# EasyEDA Pro project 航姿仪.epro

# Schematic 航姿仪原理图
Board Name: 发射板; Create Date: 2024-08-19; Page Name: P1; Project Name: 棒棒1.0; Schematic Name: 发射板原理图; Update Date: 2024-08-22
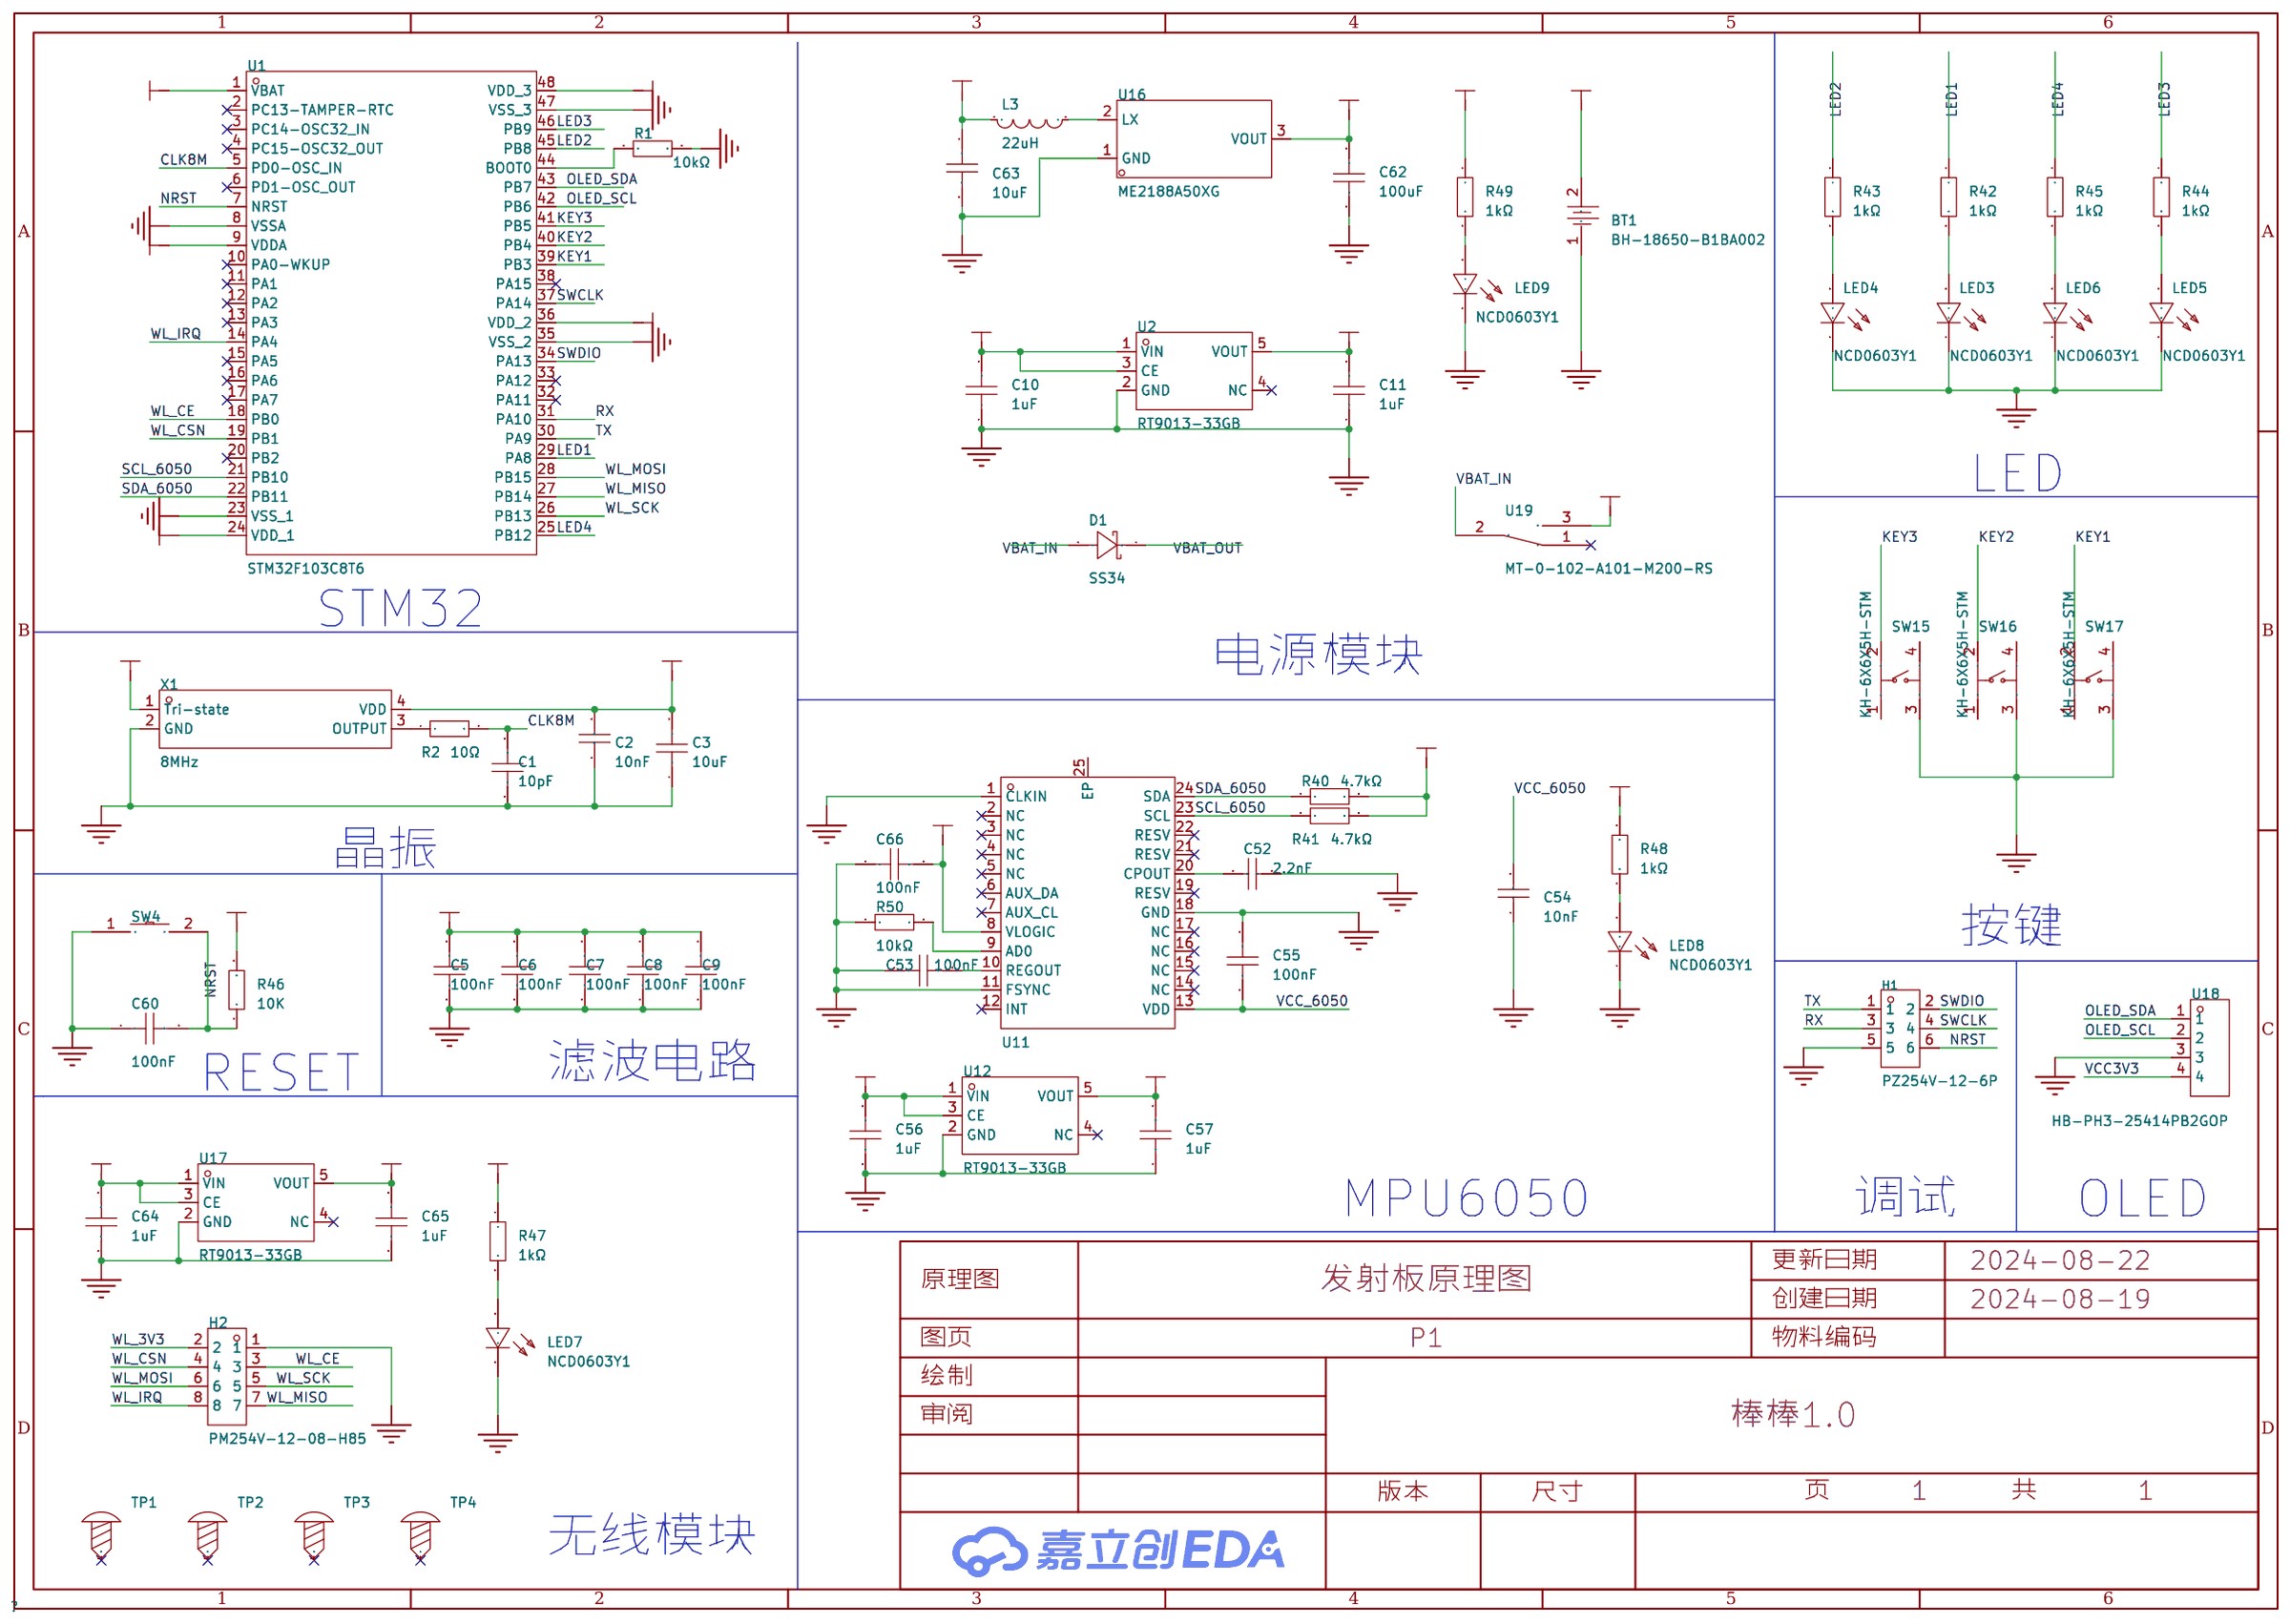
[diagram p0: schematic sheet]

## Parts
BT1  BH-18650-B1BA002  [BATTERY-SMD_18650-1S-L77.1-W20.7-1]
C1  10pF  [C0603]
C2  10nF  [C0603]
C3  10uF  [C0603]
C5  100nF  [C0603]
C6  100nF  [C0603]
C7  100nF  [C0603]
C8  100nF  [C0603]
C9  100nF  [C0603]
C10  1uF  [C0603]
C11  1uF  [C0603]
C52  2.2nF  [C0603]
C53  100nF  [C0603]
C54  10nF  [C0603]
C55  100nF  [C0603]
C56  1uF  [C0603]
C57  1uF  [C0603]
C60  100nF  [C0603]
C62  100uF  [C0603]
C63  10uF  [C0603]
C64  1uF  [C0603]
C65  1uF  [C0603]
C66  100nF  [C0603]
D1  SS34  [SMA_L4.3-W2.5-LS5.0-RD]
H1  PZ254V-12-6P  [HDR-TH_6P-P2.54-V-M-R2-C3-S2.54]
H2  PM254V-12-08-H85  [HDR-TH_8P-P2.54-V-F-R2-C4-S2.54]
L3  22uH  [IND-SMD_L7.1-W6.6]
LED3  NCD0603Y1  [LED0603-RD]
LED4  NCD0603Y1  [LED0603-RD]
LED5  NCD0603Y1  [LED0603-RD]
LED6  NCD0603Y1  [LED0603-RD]
LED7  NCD0603Y1  [LED0603-RD]
LED8  NCD0603Y1  [LED0603-RD]
LED9  NCD0603Y1  [LED0603-RD]
R1  10kΩ  [R0603]
R2  10Ω  [R0603]
R40  4.7kΩ  [R0603]
R41  4.7kΩ  [R0603]
R42  1kΩ  [R0603]
R43  1kΩ  [R0603]
R44  1kΩ  [R0603]
R45  1kΩ  [R0603]
R46  10K  [R0603]
R47  1kΩ  [R0603]
R48  1kΩ  [R0603]
R49  1kΩ  [R0603]
R50  10kΩ  [R0603]
SW4  TS-1101-C-W  [SW-SMD_L6.0-W3.3-LS8.0]
SW15  KH-6X6X5H-STM  [SW-SMD_4P-L6.0-W6.0-P4.50-LS9.0-2]
SW16  KH-6X6X5H-STM  [SW-SMD_4P-L6.0-W6.0-P4.50-LS9.0-2]
SW17  KH-6X6X5H-STM  [SW-SMD_4P-L6.0-W6.0-P4.50-LS9.0-2]
TP1  -  [M3螺丝]
TP2  -  [M3螺丝]
TP3  -  [M3螺丝]
TP4  -  [M3螺丝]
U1  STM32F103C8T6  [LQFP-48_L7.0-W7.0-P0.50-LS9.0-BL]
U2  RT9013-33GB  [SOT-23-5_L2.9-W1.6-P0.95-LS2.8-BR]
U11  MPU-6050  [QFN-24_L4.0-W4.0-P0.50-BL-EP2.7]
U12  RT9013-33GB  [SOT-23-5_L2.9-W1.6-P0.95-LS2.8-BR]
U16  ME2188A50XG  [SOT-23-3_L2.9-W1.6-P1.90-LS2.8-BR]
U17  RT9013-33GB  [SOT-23-5_L2.9-W1.6-P0.95-LS2.8-BR]
U18  HB-PH3-25414PB2GOP  [HDR-TH_4P-P2.54-V-M]
U19  MT-0-102-A101-M200-RS  [SW-TH_MT-0-103-A101-M200-RS]
X1  8MHz  [OSC-SMD_4P-L3.2-W2.5-BL_SIT8008BI]

## Library data of the parts
BT1 = BH-18650-B1BA002: 连接器类型:电池盒;适用电池规格:18650;; LCSC Part Name: 电池盒 适用电池:18650; Supplier Part: C2988620; Manufacturer: MYOUNG(美阳); Supplier Footprint: SMD; JLCPCB Part Class: 扩展库; Datasheet: https://atta.szlcsc.com/upload/public/pdf/source/20220402/870DB99AB50CA0DF8D51CF7C86A51FAB.pdf; Supplier: LCSC; Connector Type: 电池盒; Battery Type: 18650
C1 = 0603CG100J500NT: 容值:10pF;精度:±5%;额定电压:50V;材质(温度系数):C0G;; LCSC Part Name: 10pF ±5% 50V; Supplier Part: C91367; Manufacturer: FH(风华); Supplier Footprint: 0603; JLCPCB Part Class: 扩展库; Datasheet: https://atta.szlcsc.com/upload/public/pdf/source/20200305/C486355_26A10D38EF8C2A5C37091D0039909270.pdf; Supplier: LCSC; Tolerance: ±5%; Voltage Rated: 50V; Temperature Coefficient: C0G
C2 = 0603B103K500NT: 容值:10nF;精度:±10%;额定电压:50V;材质(温度系数):X7R;; LCSC Part Name: 10nF ±10% 50V; Supplier Part: C57112; Manufacturer: FH(风华); Supplier Footprint: 0603; JLCPCB Part Class: 基础库; Datasheet: https://atta.szlcsc.com/upload/public/pdf/source/20200305/C486355_26A10D38EF8C2A5C37091D0039909270.pdf; Supplier: LCSC; Tolerance: ±10%; Voltage Rated: 50V; Temperature Coefficient: X7R
C3 = CL10A106KP8NNNC: 容值:10uF;精度:±10%;额定电压:10V;材质(温度系数):X5R;; LCSC Part Name: 10uF ±10% 10V; Supplier Part: C19702; Manufacturer: SAMSUNG(三星); Supplier Footprint: 0603; JLCPCB Part Class: 基础库; Datasheet: https://atta.szlcsc.com/upload/public/pdf/source/20160218/1457707763339.pdf; Supplier: LCSC; Tolerance: ±10%; Voltage Rated: 10V; Temperature Coefficient: X5R
C5-C9 C53 C55 C66 = CC0603KRX7R9BB104: 容值:100nF;精度:±10%;额定电压:50V;材质(温度系数):X7R;; LCSC Part Name: 100nF ±10% 50V; Supplier Part: C14663; Manufacturer: YAGEO(国巨); Supplier Footprint: 0603; JLCPCB Part Class: 基础库; Datasheet: https://atta.szlcsc.com/upload/public/pdf/source/20180910/C282072_33301C7F631E79921B82A8DAC6BCC5B3.pdf; Supplier: LCSC; Tolerance: ±10%; Voltage Rated: 50V; Temperature Coefficient: X7R
C10 C11 C56 C57 C64 C65 = CL10A105KB8NNNC: 容值:1uF;精度:±10%;额定电压:50V;材质(温度系数):X5R;; LCSC Part Name: 1uF ±10% 50V; Supplier Part: C15849; Manufacturer: SAMSUNG(三星); Supplier Footprint: 0603; JLCPCB Part Class: 基础库; Datasheet: https://atta.szlcsc.com/upload/public/pdf/source/20160218/1457707763339.pdf; Supplier: LCSC; Tolerance: ±10%; Voltage Rated: 50V; Temperature Coefficient: X5R
C52 = 0603B222J500NT: 容值:2.2nF;精度:±5%;额定电压:50V;材质(温度系数):X7R;; LCSC Part Name: 2.2nF ±5% 50V; Supplier Part: C60328; Manufacturer: FH(风华); Supplier Footprint: 0603; JLCPCB Part Class: 扩展库; Datasheet: https://atta.szlcsc.com/upload/public/pdf/source/20200305/C486355_26A10D38EF8C2A5C37091D0039909270.pdf; Supplier: LCSC; Tolerance: ±5%; Voltage Rated: 50V; Temperature Coefficient: X7R
C54 = CC0603KRX7R9BB103: 容值:10nF;精度:±10%;额定电压:50V;材质(温度系数):X7R;; LCSC Part Name: 10nF ±10% 50V; Supplier Part: C100042; Manufacturer: YAGEO(国巨); Supplier Footprint: 0603; JLCPCB Part Class: 扩展库; Datasheet: https://atta.szlcsc.com/upload/public/pdf/source/20181008/C309510_22F155564471FAF6A489F7D68F34234E.pdf; Supplier: LCSC; Tolerance: ±10%; Voltage Rated: 50V; Temperature Coefficient: X7R
C60 C62 C63 = CAP_0603: Supplier Footprint: 0603
D1 = SS34_C727060: 二极管配置:独立式;正向压降(Vf):550mV@3A;直流反向耐压(Vr):40V;平均整流电流(Io):3A;; LCSC Part Name: 电压:40V 电流:3A; Supplier Part: C727060; Manufacturer: TWGMC(台湾迪嘉); Supplier Footprint: SMA(DO-214AC); JLCPCB Part Class: 扩展库; Datasheet: https://atta.szlcsc.com/upload/public/pdf/source/20200828/C727059_6599B6CAC5F3238B9C33E46794659DBE.pdf; Supplier: LCSC; Diode Configuration: 独立式; Forward Voltage (Vf@If): 550mV@3A; Reverse Voltage (Vr): 40V; Average Rectified Current (Io): 3A; Reverse Leakage Current (Ir): 500uA@40V
H1 = PZ254V-12-6P: 插针结构:2x3P;间距:2.54mm;行距:2.54mm;圆针/方针:方针;安装类型:直插;排数:双排;总PIN位数:6P;额定电流:-;额定电压:-;配合针长度:6mm;塑高:2.5mm;端接针长度:3mm;触头材质:黄铜;触头镀层:-;工作温度范围:-40℃~+105℃;颜色:黑色;; LCSC Part Name: 间距:2.54mm 2x3P 直插 方针; Supplier Part: C492420; Manufacturer: XFCN(兴飞); Supplier Footprint: 插件,P=2.54mm; JLCPCB Part Class: 扩展库; Datasheet: https://atta.szlcsc.com/upload/public/pdf/source/20200309/C492420_BAECB307B001054C09D200388220EAE6.pdf; Supplier: LCSC; Pin Structure: 2x3P; Pitch: 2.54mm; Row Spacing: 2.54mm; Circluar Pins/Square Pins: 方针; Mounting Type: 直插; Number of Rows: 双排; Number of Pins: 6P; Length of Mating Pin: 6mm; Insulation Height: 2.5mm; Length of End Connection Pin: 3mm; Contact Material: 黄铜; Operating Temperature Range: -40℃~+105℃; Color: 黑色
H2 = PM254V-12-08-H85: 插孔结构:2x4P;间距:2.54mm;行距:2.54mm;圆孔/方孔:方孔;安装类型:直插;排数:双排;总孔位数:8P;额定电流:3A;额定电压:250V;插孔方向:顶部;塑高:8.5mm;工作温度范围:-40℃~+105℃;; LCSC Part Name: 间距:2.54mm 2x4P 直插; Supplier Part: C2834799; Manufacturer: XFCN(兴飞); Supplier Footprint: 插件,P=2.54mm; JLCPCB Part Class: 扩展库; Datasheet: https://atta.szlcsc.com/upload/public/pdf/source/20200309/C492399_8C441E2934FBB604A89B37A68AA45ECF.pdf; Supplier: LCSC; Holes Structure: 2x4P; Pitch: 2.54mm; Row Spacing: 2.54mm; Circular Hole / Square Hole: 方孔; Mounting Type: 直插; Number of Rows: 双排; Number of Holes: 8P; Current Rating (Max): 3A; Voltage Rating (Max): 250V; Holes Direction: 顶部; Insulation Height: 8.5mm; Operating Temperature Range: -40℃~+105℃
L3 = YSPI0630A-220M: 电感值:22uH;精度:±20%;额定电流:3A;; LCSC Part Name: 22uH ±20%; Supplier Part: C497873; Manufacturer: YJYCOIN(益嘉源); Supplier Footprint: SMD,6.6x7.1mm; JLCPCB Part Class: 扩展库; Datasheet: https://atta.szlcsc.com/upload/public/pdf/source/20200317/C497869_D09F597887D5FB8B541C5C98B400E286.pdf; Supplier: LCSC; Tolerance: ±20%; Rated Current: 3A; DC Resistance (DCR): 130mΩ
LED3-LED9 = NCD0603Y1: 发光颜色:黄色;功率:65mW;透镜颜色:无色透明;主波长:586nm~595nm;发光强度:80mcd~220mcd;发光角度:130°;工作温度:-30℃~+85℃;; LCSC Part Name: 黄灯 0603黄灯    正贴; Supplier Part: C84268; Manufacturer: 国星光电; Supplier Footprint: 0603; JLCPCB Part Class: 扩展库; Datasheet: https://atta.szlcsc.com/upload/public/pdf/source/20200820/C84268_8FC106CB292CF978F9CFC6892464F83C.pdf; Supplier: LCSC; Emitted Color: 黄色; Forward Voltage (VF): 1.6V~2.6V; Forward Current: 20mA; Power Dissipation: 65mW; Lens Color: 无色透明; Dominant Wavelength: 586nm~595nm; Luminous Intensity: 80mcd~220mcd; Viewing Angle: 130°; Operating Temperature: -30℃~+85℃
R1 R50 = 0603WAF1002T5E: 电阻类型:厚膜电阻;阻值:10kΩ;精度:±1%;功率:100mW;最大工作电压:75V;温度系数:±100ppm/℃;; LCSC Part Name: 厚膜电阻 10kΩ ±1% 100mW; Supplier Part: C25804; Manufacturer: UNI-ROYAL(厚声); Supplier Footprint: 0603; JLCPCB Part Class: 基础库; Datasheet: https://atta.szlcsc.com/upload/public/pdf/source/20200306/C422600_1E6D84923E4A46A82E41ADD87F860B5C.pdf; Supplier: LCSC; Type: 厚膜电阻; Tolerance: ±1%; Power(Watts): 100mW; Overload Voltage (Max): 75V; Temperature Coefficient: ±100ppm/℃; Operating Temperature Range: -55℃~+155℃
R2 = 0603WAF100JT5E: 电阻类型:厚膜电阻;阻值:10Ω;精度:±1%;功率:100mW;最大工作电压:75V;温度系数:±400ppm/℃;; LCSC Part Name: 10Ω ±1% 100mW 厚膜电阻; Supplier Part: C22859; Manufacturer: UNI-ROYAL(厚声); Supplier Footprint: 0603; JLCPCB Part Class: 基础库; Datasheet: https://atta.szlcsc.com/upload/public/pdf/source/20200306/C422600_1E6D84923E4A46A82E41ADD87F860B5C.pdf; Supplier: LCSC; Type: 厚膜电阻; Tolerance: ±1%; Power(Watts): 100mW; Overload Voltage (Max): 75V; Temperature Coefficient: ±400ppm/℃; Operating Temperature Range: -55℃~+155℃
R40 R41 = 0603WAF4701T5E: 电阻类型:厚膜电阻;阻值:4.7kΩ;精度:±1%;功率:100mW;最大工作电压:75V;温度系数:±100ppm/℃;; LCSC Part Name: 4.7kΩ ±1% 100mW 厚膜电阻; Supplier Part: C23162; Manufacturer: UNI-ROYAL(厚声); Supplier Footprint: 0603; JLCPCB Part Class: 基础库; Datasheet: https://atta.szlcsc.com/upload/public/pdf/source/20200306/C422600_1E6D84923E4A46A82E41ADD87F860B5C.pdf; Supplier: LCSC; Type: 厚膜电阻; Tolerance: ±1%; Power(Watts): 100mW; Overload Voltage (Max): 75V; Temperature Coefficient: ±100ppm/℃; Operating Temperature Range: -55℃~+155℃
R42-R45 R47-R49 = 0603WAF1001T5E: 电阻类型:厚膜电阻;阻值:1kΩ;精度:±1%;功率:100mW;最大工作电压:75V;温度系数:±100ppm/℃;; LCSC Part Name: 1kΩ ±1% 100mW 厚膜电阻; Supplier Part: C21190; Manufacturer: UNI-ROYAL(厚声); Supplier Footprint: 0603; JLCPCB Part Class: 基础库; Datasheet: https://atta.szlcsc.com/upload/public/pdf/source/20200306/C422600_1E6D84923E4A46A82E41ADD87F860B5C.pdf; Supplier: LCSC; Type: 厚膜电阻; Tolerance: ±1%; Power(Watts): 100mW; Overload Voltage (Max): 75V; Temperature Coefficient: ±100ppm/℃; Operating Temperature Range: -55℃~+155℃
R46 = Res_0603: Supplier Footprint: 0603
SW4 = TS-1101-C-W: 电路结构:单刀单掷;按钮形状:矩形按钮;作用力:260gf;安装方式:立贴;开关长度:6mm;开关宽度:3.6mm;开关高度:2.5mm;带支架:不带;触点电流:50mA;额定电压(AC):-;额定电压(DC):12V;额定功率:-;绝缘电阻:-;带灯:无;机械寿命:5万次;; LCSC Part Name: 6*3.6*2.5mm 立贴 轻触开关; Supplier Part: C318938; Manufacturer: XKB Connectivity(中国星坤); Supplier Footprint: SMD; JLCPCB Part Class: 扩展库; Datasheet: https://atta.szlcsc.com/upload/public/pdf/source/20200227/C318938_C2E53B1EEDE37D980A33616AC086DE53.pdf; Supplier: LCSC; Circuit: 单刀单掷; Actuator Style: 矩形按钮; Operating Force: 260gf; Mounting Style: 立贴; Switch Length: 6mm; Switch Width: 3.6mm; Switch Height: 2.5mm; Strike Gundam: 不带; Contact Current: 50mA; Voltage Rating (DC): 12V; Actuator/Cap Color: 白色带淡绿; With Lamp: 无; Mechanical Life: 5万次; Operating Temperature: -30℃~+85℃
SW15-SW17 = KH-6X6X5H-STM: 电路结构:单刀单掷;按钮形状:圆形按钮;安装方式:立贴;开关长度:6mm;开关宽度:6mm;开关高度:5mm;带支架:不带;触点电流:50mA;额定电压(DC):12V;机械寿命:8万次;; LCSC Part Name: 6*6*5mm 立贴 轻触开关; Supplier Part: C2837531; Manufacturer: kinghelm(金航标); Supplier Footprint: SMD; JLCPCB Part Class: 扩展库; Datasheet: https://atta.szlcsc.com/upload/public/pdf/source/20210608/C2837531_45E87AB996CE723B09405FF2EA209C4C.pdf; Supplier: LCSC; Circuit: 单刀单掷; Actuator Style: 圆形按钮; Mounting Style: 立贴; Switch Length: 6mm; Switch Width: 6mm; Switch Height: 5mm; Strike Gundam: 不带; Contact Current: 50mA; Voltage Rating (DC): 12V; Actuator/Cap Color: 黑色; Pin Style: 鸥翼型; Mechanical Life: 8万次
TP1-TP4 = M3螺丝: Supplier Footprint: 插件
U1 = STM32F103C8T6: CPU内核:ARM Cortex-M3;CPU最大主频:72MHz;工作电压范围:2V~3.6V;程序存储容量:64KB;程序存储器类型:FLASH;RAM总容量:20KB;GPIO端口数量:37;; LCSC Part Name: STM32F103C8T6 MSL=3; Supplier Part: C8734; Manufacturer: ST(意法半导体); Supplier Footprint: LQFP-48(7x7); JLCPCB Part Class: 扩展库; Datasheet: https://atta.szlcsc.com/upload/public/pdf/source/20220812/8363ACEC51AD55ECEB84799464F7CB85.pdf; Supplier: LCSC; CPU Core: ARM Cortex-M3; CPU Maximum Speed: 72MHz; Operating Voltage Range: 2V~3.6V; Program Storage Size: 64KB; Program Memory Type: FLASH; RAM Size: 20KB; GPIO Ports Number: 37; ADC (Bit): 12bit; Universal Serial Bus: 有; Peripheral/Function: 看门狗；DMA；看门狗；片载温度传感器; Watchdog: 有; Infrared Data Association: 有; Low-Voltage Detect: 有; Direct Memory Access: 有; Internal Oscillator: 有; Operating Temperature Range: -40℃~+85℃
U2 U12 U17 = RT9013-33GB_1: Supplier Part: C19268157; Manufacturer: TECH PUBLIC(台舟); Supplier Footprint: SOT-23-5; Supplier: LCSC
U11 = MPU-6050: 传感器类型:加速度计陀螺仪;; Supplier Part: C24112; Manufacturer: TDK InvenSense(应美盛); Supplier Footprint: QFN-24-EP(4x4); JLCPCB Part Class: 扩展库; Datasheet: https://atta.szlcsc.com/upload/public/pdf/source/20140425/1457707046159.pdf; Supplier: LCSC; Sensor Type: 加速度计陀螺仪; Operating Temperature: -40℃~+85℃
U16 = ME2188A50XG: 功能类型:升压型;输入电压:900mV~5V;输出电压:5V;输出电流(最大值):300mA;; Supplier Part: C236769; Manufacturer: MICRONE(南京微盟); Supplier Footprint: SOT-23; JLCPCB Part Class: 扩展库; Datasheet: https://atta.szlcsc.com/upload/public/pdf/source/20180904/C236769_C3A3027972FC31986682127A7B75B9A3.pdf; Supplier: LCSC; Function: 升压型; Input Voltage: 900mV~5V; Output Voltage: 5V; Output Current (Max): 300mA; Switching Frequency: 320kHz; Synchronous Rectification: 是; Number of Outputs: 1; Topology: 升压式; Switch tube (built-in/external): 内置
U18 = HB-PH3-25414PB2GOP: 插针结构:1x4P;间距:2.54mm;行距:2.54mm;圆针/方针:方针;安装类型:直插;排数:单排;总PIN位数:4P;额定电流:3A;额定电压:250V;配合针长度:6mm;塑高:2.54mm;端接针长度:3mm;触头材质:黄铜;触头镀层:金;工作温度范围:-40℃~+105℃;焊接温度(最大值):260℃;颜色:黑色;; LCSC Part Name: 间距:2.54mm 1x4P 直插 方针; Supplier Part: C6332197; Manufacturer: HANBO(汉博); Supplier Footprint: 插件,P=2.54mm; JLCPCB Part Class: 扩展库; Datasheet: https://atta.szlcsc.com/upload/public/pdf/source/20230803/F72D259687963761DF1B552F3BB84A31.pdf; Supplier: LCSC; Pin Structure: 1x4P; Pitch: 2.54mm; Row Spacing: 2.54mm; Circluar Pins/Square Pins: 方针; Mounting Type: 直插; Number of Rows: 单排; Number of Pins: 4P; Current Rating (Max): 3A; Voltage Rating (Max): 250V; Length of Mating Pin: 6mm; Insulation Height: 2.54mm; Length of End Connection Pin: 3mm; Contact Material: 黄铜; Contact Plating: 金; Operating Temperature Range: -40℃~+105℃; Soldering Temperature(Max): 260℃; Color: 黑色
U19 = MT-0-102-A101-M200-RS: 电路结构:单刀双掷;机械寿命:-;额定电流:5A;额定电压(AC):125V;安装方式:直插;; LCSC Part Name: 小型钮子三脚二档 五件套; Supplier Part: C1788492; Manufacturer: YUEN FUNG(源丰); Supplier Footprint: 插件; JLCPCB Part Class: 扩展库; Datasheet: https://atta.szlcsc.com/upload/public/pdf/source/20230720/8E5C36EFDF374AE4FF4AC09DB233CE0E.pdf; Supplier: LCSC; Circuit: 单刀双掷; Switch Length: 13mm; Switch Width: 8mm; Switch Height: 28.6mm; Contact Current: 5A; Voltage Rating (AC): 125V; Actuator Type: 圆柱钮柄; Pin Style: 焊片; Mounting Style: 直插; Operating Temperature: -25℃~+85℃
X1 = S3D8.000000B20F30T: 频率:8MHz;工作电压:3.3V;输出模式:CMOS;频率稳定度:±20ppm;; LCSC Part Name: 8MHz ±20ppm 3.3V CMOS; Supplier Part: C387337; Manufacturer: SCTF(星通时频); Supplier Footprint: SMD3225-4P; JLCPCB Part Class: 扩展库; Datasheet: https://atta.szlcsc.com/upload/public/pdf/source/20220907/15D873D346DB6DC975109CBFB925520E.pdf; Supplier: LCSC; Supply Voltage: 3.3V; Supply Current (Max): 10mA; Output Type: CMOS; Frequency Stability: ±20ppm; Operating Temperature: -40℃~+85℃

## Nets
GND: BT1.1 C1.1 C2.1 C3.1 C5.1 C6.1 C7.1 C8.1 C9.1 C10.1 C11.1 C52.2 C53.1 C54.1 C55.2 C56.1 C57.1 C60.1 C62.1 C63.2 C64.1 C65.1 C66.1 H1.5 H2.1 LED3.1(K) LED4.1(K) LED5.1(K) LED6.1(K) LED7.1(K) LED8.1(K) LED9.1(K) R1.2 R50.1 SW4.1 SW15.3 SW16.3 SW17.3 U1.8(VSSA) U1.23(VSS_1) U1.35(VSS_2) U1.47(VSS_3) U2.2(GND) U11.1(CLKIN) U11.11(FSYNC) U11.18(GND) U12.2(GND) U16.1(GND) U17.2(GND) U18.3 X1.2(GND)
VBAT: BT1.2 U19.3
VBAT_IN: D1.2(A) U19.2
VBAT_OUT: C63.1 D1.1(C) L3.1
VCC3V3: C2.2 C3.2 C5.2 C6.2 C7.2 C8.2 C9.2 C11.2 R46.2 R49.1 U1.1(VBAT) U1.9(VDDA) U1.24(VDD_1) U1.36(VDD_2) U1.48(VDD_3) U2.5(VOUT) U18.4 X1.1(Tri-state) X1.4(VDD)
VCC_6050: C54.2 C55.1 C57.2 C66.2 R40.2 R41.2 R48.2 U11.8(VLOGIC) U11.13(VDD) U12.5(VOUT)
CLK8M: C1.2 R2.2 U1.5(PD0-OSC_IN)
KEY1: SW17.2 U1.39(PB3)
KEY2: SW16.2 U1.40(PB4)
KEY3: SW15.2 U1.41(PB5)
LED1: R42.1 U1.29(PA8)
LED2: R43.1 U1.45(PB8)
LED3: R44.1 U1.46(PB9)
LED4: R45.1 U1.25(PB12)
NRST: C60.2 H1.6 R46.1 SW4.2 U1.7(NRST)
OLED_SCL: U1.42(PB6) U18.2
OLED_SDA: U1.43(PB7) U18.1
PIVCC5V: C10.2 C56.2 C62.2 C64.2 U2.1(VIN) U2.3(CE) U12.1(VIN) U12.3(CE) U16.3(VOUT) U17.1(VIN) U17.3(CE)
RX: H1.3 U1.31(PA10)
SCL_6050: R41.1 U1.21(PB10) U11.23(SCL)
SDA_6050: R40.1 U1.22(PB11) U11.24(SDA)
SWCLK: H1.4 U1.37(PA14)
SWDIO: H1.2 U1.34(PA13)
TX: H1.1 U1.30(PA9)
WL_3V3: C65.2 H2.2 R47.1 U17.5(VOUT)
WL_CE: H2.3 U1.18(PB0)
WL_CSN: H2.4 U1.19(PB1)
WL_IRQ: H2.8 U1.14(PA4)
WL_MISO: H2.7 U1.27(PB14)
WL_MOSI: H2.6 U1.28(PB15)
WL_SCK: H2.5 U1.26(PB13)
$1N4291: R1.1 U1.44(BOOT0)
$1N4305: R2.1 X1.3(OUTPUT)
$1N7393: C53.2 U11.10(REGOUT)
$1N7409: C52.1 U11.20(CPOUT)
$1N10312: L3.2 U16.2(LX)
$1N13130: LED7.2(A) R47.2
$1N13355: LED9.2(A) R49.2
$1N13628: LED8.2(A) R48.1
$1N17897: R50.2 U11.9(AD0)
Net-(LED3-2): LED3.2(A) R42.2
Net-(LED4-2): LED4.2(A) R43.2
Net-(LED5-2): LED5.2(A) R44.2
Net-(LED6-2): LED6.2(A) R45.2

Not connected (* = marked no-connect by the designer): SW15 1 4; SW16 1 4; SW17 1 4; TP1 1*; TP2 1*; TP3 1*; TP4 1*; U1 2(PC13-TAMPER-RTC)* 3(PC14-OSC32_IN)* 4(PC15-OSC32_OUT)* 6(PD1-OSC_OUT)* 10(PA0-WKUP)* 11(PA1)* 12(PA2)* 13(PA3)* 15(PA5)* 16(PA6)* 17(PA7)* 20(PB2)* 32(PA11)* 33(PA12)* 38(PA15)*; U2 4(NC)*; U11 2(NC)* 3(NC)* 4(NC)* 5(NC)* 6(AUX_DA)* 7(AUX_CL)* 12(INT)* 14(NC)* 15(NC)* 16(NC)* 17(NC)* 19(RESV)* 21(RESV)* 22(RESV)* 25(EP); U12 4(NC)*; U17 4(NC)*; U19 1*

## Notes on the sheet
- LED
- STM32
- 电源模块
- 晶振
- 按键
- RESET
- 滤波电路
- MPU6050
- 调试
- OLED
- 无线模块

# Board PCB1
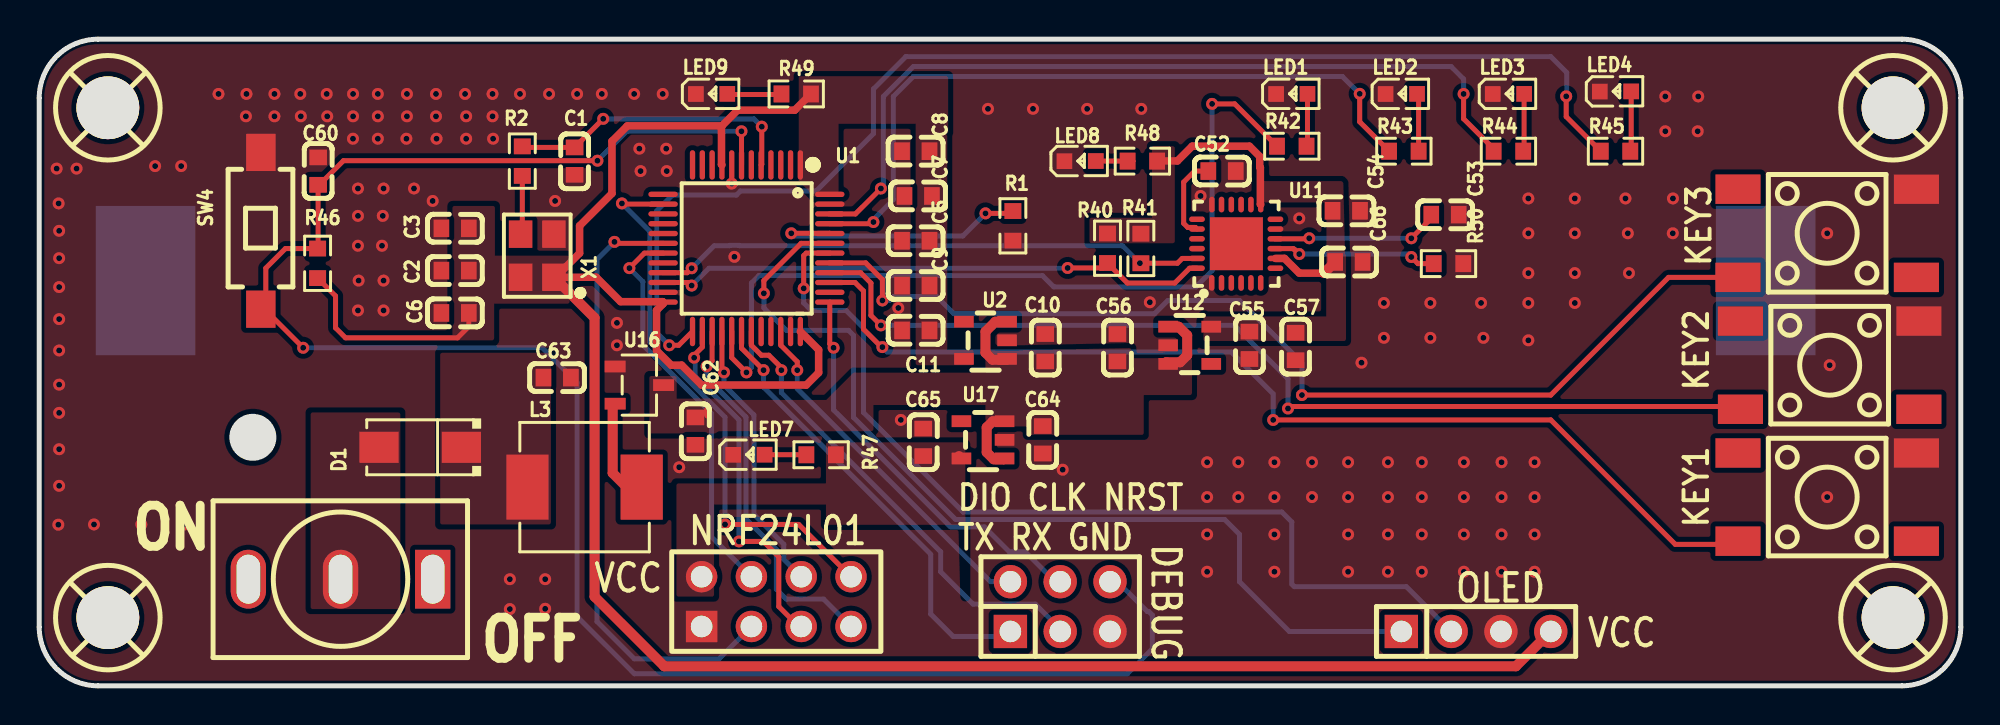
[diagram p1: board, top side]
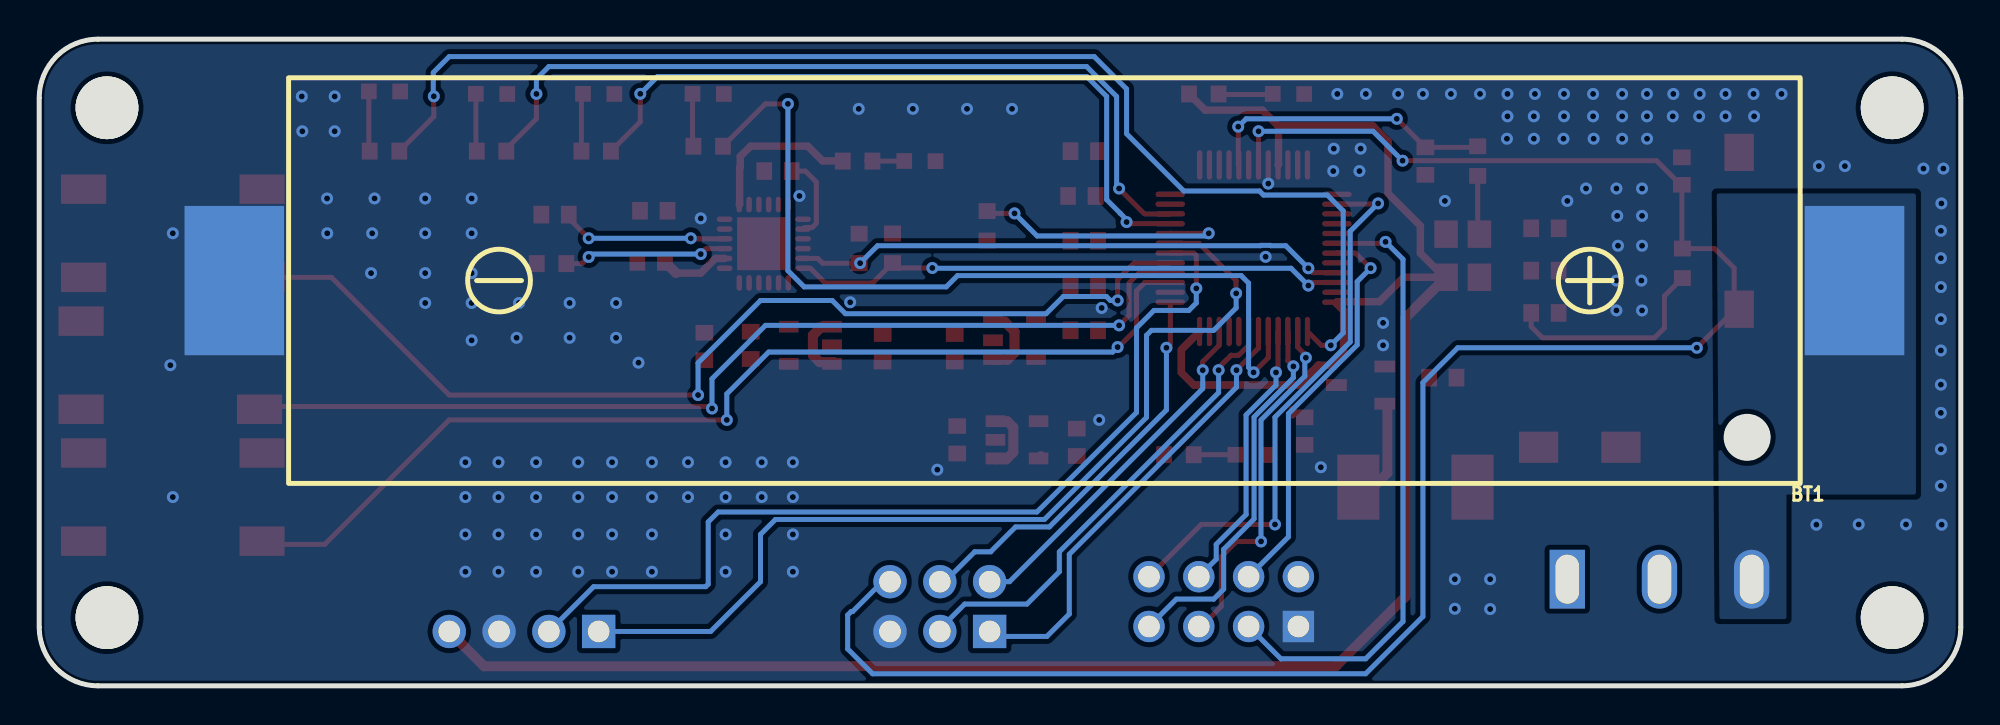
[diagram p2: board, bottom side, seen from below]

Outline 98 x 33 mm; copper layers: Top Layer, Bottom Layer. Coordinates in mm from the lower left corner of the outline.
Outline path: 0,30 0,3 arc(0.88,0.88) 3,0 95,0 arc(97.12,0.88) 98,3 98,30 arc(97.12,32.12) 95,33 3,33 arc(0.88,32.12) 0,30
Stack: Top Layer 0.035mm / Dielectric1 1.51mm FR4 er 4.5 / Bottom Layer 0.035mm

## Design rules (mm)
template: 自定义配置
spacing copperThickness1oz (default): track to track 0.102, other pairs 0.152 to 0.3
spacing copperThickness2oz: track to track 0.203, other pairs 0.152 to 0.3
track width copperThickness1oz (default): min 0.127, default 0.254, max 2.54
track width copperThickness2oz: min 0.203, default 0.254, max 2.54
differential pair differentialPair (default): width min 0.127, default 0.254, max 2.54; gap min 0.152, default 0.152
via viaSize (default): diameter min 0.5, default 0.61, max 10; hole min 0.3, default 0.305, max 6.3

## Placement (name value [footprint] x y rotation side)
BT1  BH-18650-B1BA002  [BATTERY-SMD_18650-1S-L77.1-W20.7-1]  46.74 20.68 270 bottom
C1  10pF  [C0603]  27.31 26.78 90 top
C2  10nF  [C0603]  21.21 21.19 0 top
C3  10uF  [C0603]  21.21 23.35 0 top
C5  100nF  [C0603]  44.7 22.71 0 top
C6  100nF  [C0603]  21.21 19.03 0 top
C7  100nF  [C0603]  44.83 25 0 top
C8  100nF  [C0603]  44.7 27.29 0 top
C9  100nF  [C0603]  44.7 20.43 0 top
C10  1uF  [C0603]  51.31 17.25 270 top
C11  1uF  [C0603]  44.7 18.14 0 top
C52  2.2nF  [C0603]  60.33 26.27 0 top
C53  100nF  [C0603]  71.69 24.05 180 top
C54  10nF  [C0603]  66.66 24.24 180 top
C55  100nF  [C0603]  61.72 17.38 270 top
C56  1uF  [C0603]  54.99 17.25 270 top
C57  1uF  [C0603]  64.08 17.32 90 top
C60  100nF  [C0603]  14.22 26.27 270 top
C62  100uF  [C0603]  33.47 13 90 top
C63  10uF  [C0603]  26.42 15.73 0 top
C64  1uF  [C0603]  51.18 12.56 90 top
C65  1uF  [C0603]  45.08 12.43 270 top
C66  100nF  [C0603]  66.79 21.63 180 top
D1  SS34  [SMA_L4.3-W2.5-LS5.0-RD]  19.43 12.17 180 top
H1  PZ254V-12-6P  [HDR-TH_6P-P2.54-V-M-R2-C3-S2.54]  52.07 4.04 0 top
H2  PM254V-12-08-H85  [HDR-TH_8P-P2.54-V-F-R2-C4-S2.54]  37.59 4.3 0 top
KEY1  KH-6X6X5H-STM  [SW-SMD_4P-L6.0-W6.0-P4.50-LS9.0-2]  91.19 9.63 180 top
KEY2  KH-6X6X5H-STM  [SW-SMD_4P-L6.0-W6.0-P4.50-LS9.0-2]  91.31 16.36 180 top
KEY3  KH-6X6X5H-STM  [SW-SMD_4P-L6.0-W6.0-P4.50-LS9.0-2]  91.19 23.09 180 top
L3  22uH  [IND-SMD_L7.1-W6.6]  27.81 10.14 0 top
LED1  NCD0603Y1  [LED0603-RD]  63.88 30.21 0 top
LED2  NCD0603Y1  [LED0603-RD]  69.47 30.21 0 top
LED3  NCD0603Y1  [LED0603-RD]  74.93 30.21 0 top
LED4  NCD0603Y1  [LED0603-RD]  80.39 30.33 0 top
LED7  NCD0603Y1  [LED0603-RD]  36.2 11.79 0 top
LED8  NCD0603Y1  [LED0603-RD]  53.09 26.78 0 top
LED9  NCD0603Y1  [LED0603-RD]  34.29 30.21 0 top
R1  10kΩ  [R0603]  49.66 23.48 270 top
R2  10Ω  [R0603]  24.64 26.78 90 top
R40  4.7kΩ  [R0603]  54.48 22.33 90 top
R41  4.7kΩ  [R0603]  56.18 22.32 90 top
R42  1kΩ  [R0603]  63.88 27.54 0 top
R43  1kΩ  [R0603]  69.6 27.29 0 top
R44  1kΩ  [R0603]  74.93 27.29 0 top
R45  1kΩ  [R0603]  80.39 27.29 0 top
R46  10K  [R0603]  14.2 21.56 270 top
R47  1kΩ  [R0603]  39.88 11.79 180 top
R48  1kΩ  [R0603]  56.26 26.78 0 top
R49  1kΩ  [R0603]  38.61 30.21 180 top
R50  10kΩ  [R0603]  71.87 21.55 180 top
SW4  TS-1101-C-W  [SW-SMD_L6.0-W3.3-LS8.0]  11.3 23.22 270 top
TP1  -  [M3螺丝]  94.61 29.44 0 top
TP2  -  [M3螺丝]  94.61 3.42 0 top
TP3  -  [M3螺丝]  3.56 29.44 0 top
TP4  -  [M3螺丝]  3.56 3.42 0 top
U1  STM32F103C8T6  [LQFP-48_L7.0-W7.0-P0.50-LS9.0-BL]  36.07 22.33 180 top
U2  RT9013-33GB  [SOT-23-5_L2.9-W1.6-P0.95-LS2.8-BR]  48.26 17.63 0 top
U11  MPU-6050  [QFN-24_L4.0-W4.0-P0.50-BL-EP2.7]  61.05 22.56 0 top
U12  RT9013-33GB  [SOT-23-5_L2.9-W1.6-P0.95-LS2.8-BR]  58.67 17.38 180 top
U16  ME2188A50XG  [SOT-23-3_L2.9-W1.6-P1.90-LS2.8-BR]  30.61 15.35 180 top
U17  RT9013-33GB  [SOT-23-5_L2.9-W1.6-P0.95-LS2.8-BR]  48.13 12.55 0 top
U18  HB-PH3-25414PB2GOP  [HDR-TH_4P-P2.54-V-M]  73.28 2.77 0 top
U19  MT-0-102-A101-M200-RS  [SW-TH_MT-0-103-A101-M200-RS]  15.37 5.44 180 top
X1  8MHz  [OSC-SMD_4P-L3.2-W2.5-BL_SIT8008BI]  25.4 21.95 90 top

## Footprints (pads in the part's own frame, mm; a bottom-side part is the same pattern mirrored in y, then rotated)
BATTERY-SMD_18650-1S-L77.1-W20.7-1
  rect 7.62x5.08 smd: 1(0,-41.313) 2(0,41.313)
C0603
  rect 0.8x0.9 smd: 1(-0.7,0) 2(0.7,0)
HDR-TH_4P-P2.54-V-M
  rect 1.7x1.7 hole 1.1: 1(-3.81,0)
  round 1.7 hole 1.1: 2(-1.27,0) 3(1.27,0) 4(3.81,0)
HDR-TH_6P-P2.54-V-M-R2-C3-S2.54
  rect 1.7x1.7 hole 1.1: 1(-2.54,-1.27)
  round 1.7 hole 1.1: 2(-2.54,1.27) 3(0,-1.27) 4(0,1.27) 5(2.54,-1.27) 6(2.54,1.27)
HDR-TH_8P-P2.54-V-F-R2-C4-S2.54
  rect 1.6x1.6 hole 1.1: 1(-3.81,-1.27)
  round 1.6 hole 1.1: 2(-3.81,1.27) 3(-1.27,-1.27) 4(-1.27,1.27) 5(1.27,-1.27) 6(1.27,1.27) 7(3.81,-1.27) 8(3.81,1.27)
IND-SMD_L7.1-W6.6
  rect 2.15x3.32 smd: 1(-2.913,0) 2(2.913,0)
LED0603-RD
  rect 0.8x0.8 smd: 1(-0.799,-0.004) 2(0.799,0.004)
LQFP-48_L7.0-W7.0-P0.50-LS9.0-BL
  oval 0.27x1.5 smd: 1(-2.75,-4.25) 2(-2.25,-4.25) 3(-1.75,-4.25) 4(-1.25,-4.25) 5(-0.75,-4.25) 6(-0.25,-4.25) 7(0.25,-4.25) 8(0.75,-4.25) 9(1.25,-4.25) 10(1.75,-4.25) 11(2.25,-4.25) 12(2.75,-4.25) 25(2.75,4.25) 26(2.25,4.25) 27(1.75,4.25) 28(1.25,4.25) 29(0.75,4.25) 30(0.25,4.25) 31(-0.25,4.25) 32(-0.75,4.25) 33(-1.25,4.25) 34(-1.75,4.25) 35(-2.25,4.25) 36(-2.75,4.25)
  oval 1.5x0.27 smd: 13(4.25,-2.75) 14(4.25,-2.25) 15(4.25,-1.75) 16(4.25,-1.25) 17(4.25,-0.75) 18(4.25,-0.25) 19(4.25,0.25) 20(4.25,0.75) 21(4.25,1.25) 22(4.25,1.75) 23(4.25,2.25) 24(4.25,2.75) 37(-4.25,2.75) 38(-4.25,2.25) 39(-4.25,1.75) 40(-4.25,1.25) 41(-4.25,0.75) 42(-4.25,0.25) 43(-4.25,-0.25) 44(-4.25,-0.75) 45(-4.25,-1.25) 46(-4.25,-1.75) 47(-4.25,-2.25) 48(-4.25,-2.75)
M3螺丝
  round 3.2 hole 3.2: 1(-0.064,0.064)
OSC-SMD_4P-L3.2-W2.5-BL_SIT8008BI
  rect 1.4x1.2 smd: 1(-1.1,-0.85) 2(1.1,-0.85) 3(1.1,0.85) 4(-1.1,0.85)
QFN-24_L4.0-W4.0-P0.50-BL-EP2.7
  oval 0.28x0.8 smd: 1(-1.25,-2) 2(-0.75,-2) 3(-0.25,-2) 4(0.25,-2) 5(0.75,-2) 6(1.25,-2) 13(1.25,2) 14(0.75,2) 15(0.25,2) 16(-0.25,2) 17(-0.75,2) 18(-1.242,2)
  oval 0.8x0.28 smd: 7(2,-1.25) 8(2,-0.75) 9(2,-0.25) 10(2,0.25) 11(2,0.75) 12(2,1.25) 19(-2,1.25) 20(-2,0.75) 21(-2,0.25) 22(-2,-0.25) 23(-2,-0.75) 24(-2,-1.25)
  rect 2.7x2.7 smd: 25(0.013,0)
R0603
  rect 0.806x0.864 smd: 1(-0.753,0) 2(0.753,0)
SMA_L4.3-W2.5-LS5.0-RD
  rect 2x1.593 smd: 1(-2.1,0) 2(2.1,0)
SOT-23-3_L2.9-W1.6-P1.90-LS2.8-BR
  rect 1.07x0.6 smd: 1(1.235,-0.95) 2(1.235,0.95) 3(-1.235,0)
SOT-23-5_L2.9-W1.6-P0.95-LS2.8-BR
  rect 1x0.6 smd: 1(1.1,-0.95) 2(1.1,0) 3(1.1,0.95) 4(-1.1,0.95) 5(-1.1,-0.95)
SW-SMD_4P-L6.0-W6.0-P4.50-LS9.0-2
  rect 2.3x1.5 smd: 1(-4.55,2.25) 2(4.55,2.25) 3(-4.55,-2.25) 4(4.55,-2.25)
SW-SMD_L6.0-W3.3-LS8.0
  rect 1.9x1.5 smd: 1(-4,0) 2(4,0)
SW-TH_MT-0-103-A101-M200-RS
  rect 1.8x3 hole 1.2x2.5: 1(-4.7,0)
  oval 1.8x3 hole 1.2x2.5: 2(0,0) 3(4.7,0)

## Nets
As in the schematic, except:
GND: BT1.1 C1.1 C2.1 C3.1 C5.1 C6.1 C7.1 C8.1 C9.1 C10.1 C11.1 C52.2 C53.1 C54.1 C55.2 C56.1 C57.1 C60.1 C62.1 C63.2 C64.1 C65.1 C66.1 H1.5 H2.1 KEY1.3 KEY2.3 KEY3.3 LED1.1 LED2.1 LED3.1 LED4.1 LED7.1 LED8.1 LED9.1 R1.2 R50.1 SW4.1 U1.8 U1.23 U1.35 U1.47 U2.2 U11.1 U11.11 U11.18 U12.2 U16.1 U17.2 U18.3 X1.2
KEY1: KEY1.2 U1.39
KEY2: KEY2.2 U1.40
KEY3: KEY3.2 U1.41
$1N8247: LED1.2 R42.2
$1N8385: LED2.2 R43.2
$1N8593: LED3.2 R44.2
$1N8599: LED4.2 R45.2

Pads without a net: KEY1 1 4; KEY2 1 4; KEY3 1 4; TP1 1; TP2 1; TP3 1; TP4 1; U1 2 3 4 6 10 11 12 13 15 16 17 20 32 33 38; U2 4; U11 2 3 4 5 6 7 12 14 15 16 17 19 21 22 25; U12 4; U17 4; U19 1

## Via types
v1: diameter 0.61, hole 0.305, Top Layer to Bottom Layer, 194 vias

## Routing (per net, layer and track width the routed paths; a pad name or vN(x,y) marks a point on that pad's centre or on a via; arc(x,y) is an arc through that point)
GND: length 0.2
  Top Layer w0.254: 79.47,30.21 LED4.1
  vias: v1(0.89,26.4) v1(0.99,24.62) v1(1.02,23.22) v1(1.02,21.82) v1(1.02,20.35) v1(1.02,18.71) v1(1.02,17.12) v1(1.02,15.37) v1(1.02,13.93) v1(1.02,12.07) v1(1.02,10.21) v1(0.97,8.22) v1(1.91,26.4) v1(2.79,8.23) v1(5.21,8.23) v1(5.91,26.52) v1(7.24,26.52) v1(7.37,8.22) v1(9.14,30.21) v1(10.57,30.21) v1(10.54,29.06) v1(12,30.21) v1(12,29.06) v1(13.31,30.21) v1(13.34,29.06) v1(14.66,30.21) v1(14.69,29.06) v1(16.01,30.21) v1(16.01,29.06) v1(16,27.92) v1(16.26,25.38) v1(16.26,23.98) v1(16.26,22.46) v1(16.29,20.68) v1(16.26,19.16) v1(17.27,30.21) v1(17.27,29.06) v1(17.27,27.92) v1(17.52,23.98) v1(17.48,22.46) v1(17.56,25.38) v1(17.56,20.68) v1(17.56,19.16) v1(18.75,30.21) v1(18.75,29.06) v1(18.73,27.92) v1(19.11,25.38) v1(20.07,24.75) v1(20.24,30.21) v1(20.24,29.06) v1(20.26,27.92) v1(21.72,30.21) v1(21.77,29.06) v1(21.77,27.92) v1(23.12,30.21) v1(23.12,29.06) v1(23.15,27.92) v1(24,5.44) v1(24,3.92) v1(24.52,30.21) v1(25.8,5.44) v1(25.8,3.93) v1(26,30.21) v1(26.31,24.75) v1(27.43,30.21) v1(28.69,30.21) v1(29.46,18.52) v1(29.46,17.38) v1(30.34,30.21) v1(30.61,27.41) v1(30.67,26.27) v1(31.8,30.21) v1(31.98,27.41) v1(32,26.27) v1(32.64,11.16) v1(35.32,25.63) v1(35.45,21.89) v1(43.82,19.28) v1(43.94,13.57) v1(48.39,29.44) v1(50.68,29.44) v1(52.2,11.03) v1(53.44,29.44) v1(56.21,29.44) v1(56.64,19.58) v1(59.23,25) v1(59.56,11.41) v1(59.56,9.63) v1(59.56,7.73) v1(59.56,5.82) v1(61.15,11.41) v1(61.15,9.63) v1(62.99,11.41) v1(62.99,9.63) v1(62.99,7.73) v1(62.99,5.82) v1(64.26,23.86) v1(64.91,11.41) v1(64.91,9.63) v1(66.75,11.41) v1(66.75,9.63) v1(66.75,7.73) v1(66.75,5.82) v1(67.44,16.49) v1(68.58,19.54) v1(68.58,17.76) v1(68.79,11.41) v1(68.79,9.63) v1(68.79,7.73) v1(68.79,5.82) v1(70.51,11.41) v1(70.51,9.63) v1(70.51,7.73) v1(70.51,5.82) v1(70.95,19.54) v1(70.95,17.76) v1(72.66,11.41) v1(72.66,9.63) v1(72.66,7.73) v1(72.66,5.82) v1(73.53,19.54) v1(73.65,17.76) v1(74.58,11.41) v1(74.58,9.63) v1(74.58,7.73) v1(74.58,5.82) v1(75.95,24.87) v1(75.95,23.09) v1(75.95,21.06) v1(75.95,19.54) v1(75.95,17.63) v1(76.26,11.41) v1(76.26,9.63) v1(76.26,7.73) v1(76.26,5.82) v1(78.32,24.87) v1(78.32,23.09) v1(78.32,21.06) v1(78.32,19.54) v1(80.9,24.87) v1(81.02,23.09) v1(81.08,21.06) v1(82.93,30.08) v1(82.93,28.3) v1(83.32,24.87) v1(83.31,23.09) v1(84.61,30.08) v1(84.58,28.3) v1(91.19,23.09) v1(91.19,9.63) v1(91.31,16.36)
VCC3V3: length 120.7
  Top Layer w0.254: C6.2 21.91,18.33 21.34,17.76 15.62,17.76 15.11,18.27 15.11,19.89 R46.2
  Top Layer w0.381: 26.33,20.85 28.41,20.85 29.65,19.6 31.8,19.6 U1.24 31.82,19.49 31.48,19.16 31.48,17.11 32.23,16.36 32.77,16.36 33.78,15.35 39.12,15.35 39.75,15.98 39.75,17.15 U1.36 ; 26.33,20.85 X1.1 ; 26.33,20.85 27.56,22.08 27.56,23.48 29.21,25.13 29.21,27.79 29.99,28.58 34.82,28.58 ; 34.82,28.58 35.62,29.38 38.54,29.38 R49.1 ; 34.82,28.58 34.8,28.55 34.8,26.6 U1.9
  Top Layer w0.508: X1.1 28.32,18.78 28.32,4.55 31.88,1 75.31,1 U18.4
VCC_6050: length 11.6
  Top Layer w0.381: U11.8 63.51,21.81 64.26,21.06 65.52,21.06 ; 57.28,26.79 58.05,26.79 58.8,27.54 61.72,27.54 62.25,27.02 62.25,26.48 62.28,26.44 62.28,24.58 U11.13
  Top Layer w0.508: 65.52,21.06 C66.2
CLK8M: length 15
  Top Layer w0.254: v1(36.85,28.53) 36.85,26.61 U1.5 ; 24.64,27.4 24.71,27.48 C1.2 v1(28.76,28.94)
  Bottom Layer w0.254: v1(36.85,28.53) 36.45,28.94 v1(28.76,28.94)
KEY1: length 53.8
  Top Layer w0.254: KEY1.2 86.47,7.22 83.44,7.22 77.09,13.57 v1(62.93,13.57) ; U1.39 41.61,20.58 42.04,20.15 42.04,18.2 42.95,17.29 v1(43,17.29)
  Bottom Layer w0.254: v1(43,17.29) 43.26,17.03 60.8,17.03 62.93,14.9 v1(62.93,13.57)
KEY2: length 51.3
  Top Layer w0.254: U1.40 41.89,21.08 42.42,20.55 42.42,18.9 v1(42.93,18.4) ; v1(63.69,14.15) 63.79,14.26 86.62,14.26 KEY2.2
  Bottom Layer w0.254: v1(42.93,18.4) 60.96,18.4 63.69,15.67 v1(63.69,14.15)
KEY3: length 53.9
  Top Layer w0.254: v1(43,19.67) 43,20.73 42.15,21.58 U1.41 ; v1(64.4,14.84) 77.09,14.84 83.09,20.84 KEY3.2
  Bottom Layer w0.254: v1(64.4,14.84) 64.4,16.48 61.21,19.67 57.56,19.67 56.88,18.99 46.65,18.99 45.77,19.87 43.57,19.87 43.37,19.67 v1(43,19.67)
LED1: length 44
  Top Layer w0.254: R42.1 60.97,29.7 v1(59.82,29.7) ; U1.29 35.32,16.74 v1(36.07,15.99)
  Bottom Layer w0.254: v1(36.07,15.99) 36.32,16.25 36.32,20.55 36.7,20.94 51.17,20.94 51.74,20.36 58.99,20.36 59.82,21.19 v1(59.82,29.7)
LED2: length 37.2
  Top Layer w0.254: R43.1 67.35,28.78 v1(67.35,30.21) ; U1.45 42.46,23.58 v1(42.55,23.67)
  Bottom Layer w0.254: v1(42.55,23.67) 42.53,23.68 42.53,23.78 42.88,24.12 42.88,24.12 43.56,24.81 43.56,30.08 44.58,31.09 66.46,31.09 v1(67.35,30.21)
LED3: length 42.7
  Top Layer w0.254: v1(72.64,30.21) 72.64,28.94 74.18,27.4 R44.1 ; v1(42.93,25.38) 41.63,24.08 U1.46
  Bottom Layer w0.254: v1(42.93,25.38) 43.05,25.51 43.05,30.07 44.58,31.6 72.01,31.6 72.64,30.97 v1(72.64,30.21)
LED4: length 64.7
  Top Layer w0.254: R45.1 77.88,29.05 v1(77.88,30.08) ; U1.25 32.61,17.38 v1(32.13,17.38)
  Bottom Layer w0.254: v1(32.13,17.38) 31.5,18.01 31.5,24.24 32.3,25.05 35.56,25.05 35.77,25.25 39.62,25.25 42.55,28.17 42.55,30.46 44.2,32.11 77.09,32.11 77.9,31.3 77.9,30.11 v1(77.88,30.08)
NRST: length 98.1
  Top Layer w0.254: v1(28.47,26.8) 15.52,26.8 14.29,25.57 C60.2 14.22,22.34 14.2,22.31 12.56,22.31 11.56,21.32 11.56,19.48 SW4.2 11.49,19.22 v1(13.46,17.25) ; U1.7 35.82,28.3 v1(35.81,28.3)
  Bottom Layer w0.254: v1(35.81,28.3) 29.97,28.3 v1(28.47,26.8) ; 54.61,5.06 55.24,5.06 56.52,3.79 56.59,3.79 56.77,3.61 56.77,1.89 55.5,0.62 30.35,0.62 27.43,3.54 27.43,15.47 25.65,17.25 v1(13.46,17.25)
OLED_SCL: length 48.2
  Top Layer w0.254: v1(38.99,20.28) 38.99,21.95 39.12,22.08 U1.42
  Bottom Layer w0.254: U18.2 69.72,5.06 64.01,5.06 63.88,5.19 63.88,8.36 63.37,8.87 47.12,8.87 42.04,13.95 42.04,18.27 41.15,19.16 39.37,19.16 38.99,19.54 v1(38.99,20.28)
OLED_SDA: length 48.8
  Top Layer w0.254: v1(36.96,20.03) 36.96,20.68 38.86,22.58 U1.43
  Bottom Layer w0.254: v1(36.96,20.03) 36.96,19.28 38.1,18.14 41.27,18.14 41.53,17.89 41.53,13.7 46.74,8.49 60.45,8.49 61.21,7.73 61.21,5.31 63.75,2.77 U18.1
PIVCC5V: length 11.1
  Top Layer w0.381: 34.1,13.82 34.1,14.08
  Top Layer w0.508: U2.3 48.77,18.58 48.26,18.08 48.26,17 48.62,16.64 49.32,16.64 U2.1 ; U17.3 48.64,13.5 48.32,13.19 48.32,11.92 48.68,11.56 49.19,11.56 49.23,11.6 ; 57.36,18.33 58.11,18.33 58.55,17.89 58.55,16.87 58.19,16.51 57.47,16.51 57.39,16.43 57.36,16.43
RX: length 24.2
  Top Layer w0.254: U1.31 36.32,17.38 36.83,16.87 37.21,16.87 37.85,16.23 v1(37.85,16.11)
  Bottom Layer w0.254: 52.07,2.52 52.07,2.9 50.8,4.17 47.63,4.17 45.97,5.82 45.97,6.84 37.85,14.96 v1(37.85,16.11)
SCL_6050: length 28.2
  Top Layer w0.254: U11.23 58.29,21.81 58.05,21.57 R41.1 ; U1.21 33.05,21.08 v1(33.27,21.31)
  Bottom Layer w0.254: v1(56.13,21.57) 55.24,22.46 35.71,22.46 35.7,22.48 35.21,22.48 35.19,22.46 34.42,22.46 v1(33.27,21.31)
SDA_6050: length 28.5
  Top Layer w0.254: v1(33.27,20.43) 33.12,20.58 U1.22 ; R40.1 54.23,21.32 v1(52.45,21.32) ; U11.24 58.67,21.31 57.91,20.55 55.5,20.55 54.48,21.57
  Bottom Layer w0.254: v1(52.45,21.32) 52.44,21.31 34.16,21.31 v1(33.27,20.43)
SWCLK: length 20.9
  Top Layer w0.254: v1(40.51,17.25) 40.32,17.45 U1.37
  Bottom Layer w0.254: v1(40.51,17.25) 40.51,14.08 46.48,8.11 48.21,8.11 49.48,6.84 50.29,6.84 52.07,5.06
SWDIO: length 18.2
  Top Layer w0.254: v1(38.66,16.11) 38.66,16.54 37.82,17.38 U1.34
  Bottom Layer w0.254: v1(38.66,16.11) 38.66,15.17 48.51,5.31 H1.2
TX: length 23
  Top Layer w0.254: U1.30 35.82,17.23 v1(36.94,16.11)
  Bottom Layer w0.254: v1(36.94,16.11) 36.94,15.24 45.47,6.71 45.47,3.66 46.61,2.52 49.53,2.52
WL_3V3: length 0.2
  Top Layer w0.508: 47.03,11.6 46.91,11.73
WL_CE: length 31.6
  Top Layer w0.254: v1(29.34,22.66) 29.41,22.58 U1.18
  Bottom Layer w0.254: H2.3 34.67,1.38 30.35,1.38 28.45,3.28 28.45,21.77 v1(29.34,22.66)
WL_CSN: length 20.4
  Top Layer w0.254: U1.19 30.86,22.08 v1(30.1,21.32)
  Bottom Layer w0.254: H2.4 34.29,7.6 34.29,13.89 30.78,17.4 30.78,20.63 v1(30.1,21.32)
WL_IRQ: length 28.2
  Top Layer w0.254: H2.8 38.73,8.23 v1(34.98,8.23) ; v1(29.72,24.62) 29.75,24.58 U1.14
  Bottom Layer w0.254: v1(34.98,8.23) 34.98,13.71 31.14,17.54 31.14,23.2 v1(29.72,24.62)
WL_MISO: length 19.3
  Top Layer w0.254: U1.27 34.32,16.58 v1(34.04,16.3)
  Bottom Layer w0.254: v1(34.04,16.3) 34.04,15.72 36.04,13.72 36.04,8.51 37.59,6.97 37.59,4.93 38.1,4.42 40.01,4.42 H2.7
WL_MOSI: length 14.2
  Top Layer w0.254: v1(34.92,15.99) 34.82,16.1 U1.28
  Bottom Layer w0.254: H2.6 37.97,6.46 37.97,7.22 36.45,8.74 36.45,13.82 34.92,15.35 v1(34.92,15.99)
WL_SCK: length 18.3
  Top Layer w0.254: H2.5 38.73,3.03 37.72,4.04 37.72,6.58 36.93,7.37 v1(35.69,7.37) ; v1(33.4,16.74) 33.4,16.87 33.82,17.29 U1.26
  Bottom Layer w0.254: v1(33.4,16.74) 33.45,16.69 33.45,15.8 35.69,13.57 v1(35.69,7.37)
$1N4291: length 13.9
  Top Layer w0.254: v1(48.26,24.11) 49.54,24.11 R1.1 ; U1.44 40.31,23.09 v1(38.35,23.09)
  Bottom Layer w0.254: v1(48.26,24.11) 47.11,22.96 38.49,22.96 v1(38.35,23.09)
$1N4305: length 3
  Top Layer w0.254: X1.3 24.64,23.14 R2.1
$1N7393: length 8.6
  Top Layer w0.254: v1(69.98,22.84) 70.99,23.86 C53.2 ; v1(64.77,22.84) 64.74,22.81 U11.10
  Bottom Layer w0.254: v1(64.77,22.84) v1(69.98,22.84)
$1N7409: length 4.4
  Top Layer w0.254: U11.20 58.97,23.39 58.58,23.39 58.37,23.6 58.37,25.71 58.93,26.27 C52.1
$1N8247: length 2.7
  Top Layer w0.254: 64.51,27.54 64.68,27.71 LED1.2
$1N8385: length 3
  Top Layer w0.254: LED2.2 70.35,30.13 R43.2
$1N8593: length 2.9
  Top Layer w0.254: R44.2 75.73,27.33 LED3.2
$1N8599: length 3.1
  Top Layer w0.254: LED4.2 81.19,27.33 R45.2
$1N10312: length 5.4
  Top Layer w0.508: L3.2 29.96,10.14 29.25,10.86 29.25,14.27 29.37,14.4
$1N13130: length 2.1
  Top Layer w0.254: LED7.2 39.12,11.79 R47.2
$1N13355: length 2.8
  Top Layer w0.254: LED9.2 35.09,30.18 37.83,30.18 R49.2
$1N13628: length 1.5
  Top Layer w0.254: 54.27,26.78 55.78,26.78 55.78,26.79
$1N17897: length 8.4
  Top Layer w0.254: R50.2 70.32,21.55 v1(69.98,21.89) ; U11.9 63.96,22.31 64.02,22.26 64.04,22.26 v1(64.26,22.03)
  Bottom Layer w0.254: v1(64.26,22.03) 69.83,22.03 v1(69.98,21.89)

## Copper pours and planes (outline as drawn; the poured copper is in the pictures)
GND on Top Layer: -0.63,34.02 98.81,34.02 98.81,-1.67 -0.63,-1.67
GND on Bottom Layer: -1.27,34.52 98.81,34.52 98.81,-2.69 -1.27,-2.69
VBAT on Bottom Layer: 12.31,3.41 12.45,25.13 2.29,25.13 2.29,9.76 8.89,9.76 8.89,3.41
VBAT_IN on Top Layer: 13.84,3.92 18.42,3.92 18.42,13.95 13.84,13.95
VBAT_OUT on Top Layer: 20.45,17 20.45,8.23 26.1,8.23 26.1,16.94 26.16,17
VCC3V3 on Top Layer: 44.7,16.36 44.7,28.68 40.77,28.68 40.77,24.92 39.58,24.92 38.73,25.76 38.73,31.11 46.36,31.11 46.36,28.24 46.29,28.17 46.23,28.17 46.3,28.1 46.3,17.14 47.66,17.14 47.66,16.36
VCC3V3 on Top Layer: 21.07,17.75 20.95,17.63 23.2,17.63 23.2,19.5 27.01,19.5 27.05,19.54 27.05,21.95 23.24,21.95 23.24,24.49 21.07,24.49
VCC_6050 on Top Layer: 57.92,22.59 57.91,22.59 53.56,22.59 53.56,23.88 56.75,23.88 56.75,27.54 57.92,27.54
VCC_6050 on Top Layer: 66.51,25.67 66.59,22.03 66.65,21.98 66.65,17.6 59.53,17.6 59.37,17.44 59.37,18.9 59.44,18.9 59.49,18.85 65.63,18.85 65.63,22.03 65.65,22.03 65.65,24.67 62.28,24.67 62.28,25.76 62.28,25.76 66.42,25.76
PIVCC5V on Top Layer: 31.11,12.88 34.45,12.88 34.64,12.99 34.67,12.87 34.67,14.66 32.51,14.66 32.51,15.81 31.12,15.81 31.11,15.73
PIVCC5V on Top Layer: 41.53,15.98 48.26,15.98 48.26,17.12 50.16,17.12 55.7,17.24 55.7,16.72 58.79,16.72 58.79,14.84 56.33,14.84 56.33,12.81 50.42,12.81 50.42,13.24 48.29,13.24 48.32,13.5 48.26,13.44 48.26,14.33 42.55,14.33 42.55,13.06 42.48,12.99 32.85,12.99 32.85,14.71 32.89,14.71 33.01,14.59 40.14,14.59
WL_3V3 on Top Layer: 32.5,10.33 40.12,10.33 40.12,12.43 47.12,12.43 47.23,12.31 47.23,4.56 47.13,8.21 40.12,8.21 40.12,9.25 34.42,9.25 34.42,4.55 32.5,4.55

## Text on the board
Top Silkscreen Layer: DIO CLK NRST / TX RX GND | VCC | NRF24L01 | OLED | DEBUG | ON | OFF
